# Altium schematic sheet RL78.SchDoc: RL78
size A4; DrawnBy: JR; Revision: 0.1; SheetNumber: 1; SheetTotal: 1
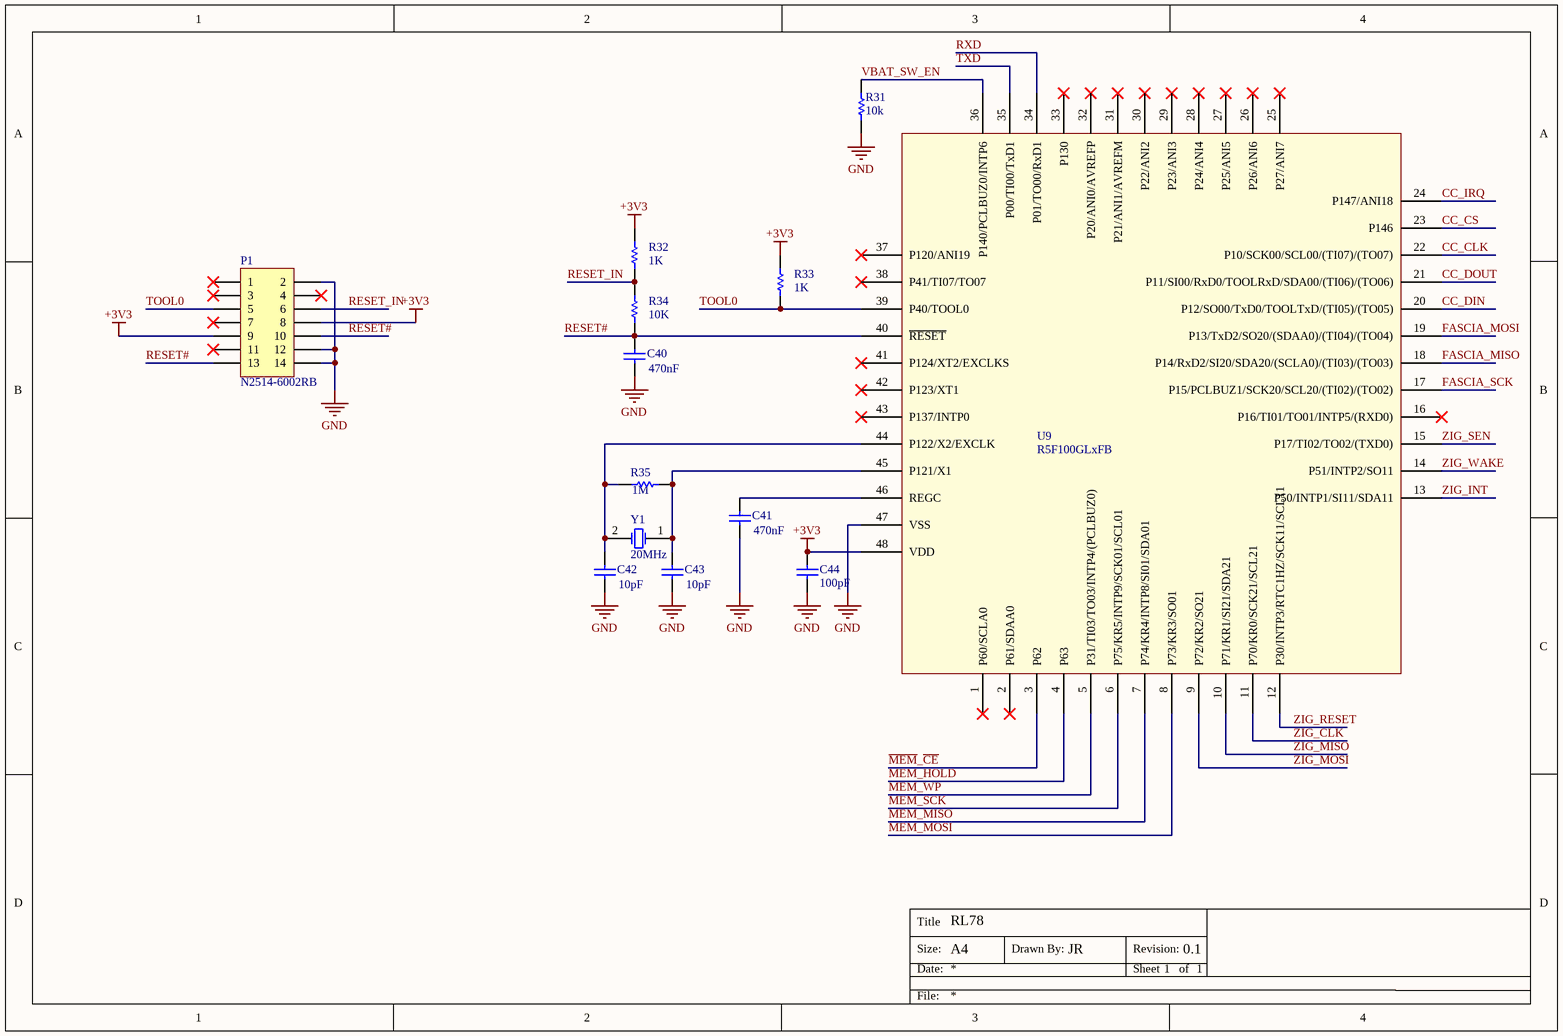
[diagram p0: RL78.SchDoc]

## Parts
C40  value 470nF  [CAPC1005L]  (hidden comment: Cap)
C41  value 470nF  [CAPC1005L]  (hidden comment: Cap)
C42  value 10pF  [CAPC1005L]  (hidden comment: Cap)
C43  value 10pF  [CAPC1005L]  (hidden comment: Cap)
C44  value 100pF  [CAPC1005L]  (hidden comment: Cap)
P1  N2514-6002RB  [N2514-6002RB]
R31  value 10k  [RESC1005L]  (hidden comment: RC0603JR-0768KL)
R32  value 1K  [RESC1608L]  (hidden comment: Res1)
R33  value 1K  [RESC1005L]  (hidden comment: Res1)
R34  value 10K  [RESC1608L]  (hidden comment: Res1)
R35  value 1M  [RESC1005L]  (hidden comment: Res1)
U9  R5F100GLxFB  [R5F100GLxFB]
Y1  20MHz  [32Mhz Crystal]

## Nets
+3V3: C44.2 P1.8 P1.9 R32.2 R33.2 U9.48(VDD)
GND: C40.1 C41.1 C42.1 C43.1 C44.1 P1.2 P1.12 P1.14 R31.2 U9.47(VSS)
CC_CLK: U9.22(P10/SCK00/SCL00/(TI07)/(TO07))
CC_CS: U9.23(P146)
CC_DIN: U9.20(P12/SO00/TxD0/TOOLTxD/(TI05)/(TO05))
CC_DOUT: U9.21(P11/SI00/RxD0/TOOLRxD/SDA00/(TI06)/(TO06))
CC_IRQ: U9.24(P147/ANI18)
FASCIA_MISO: U9.18(P14/RxD2/SI20/SDA20/(SCLA0)/(TI03)/(TO03))
FASCIA_MOSI: U9.19(P13/TxD2/SO20/(SDAA0)/(TI04)/(TO04))
FASCIA_SCK: U9.17(P15/PCLBUZ1/SCK20/SCL20/(TI02)/(TO02))
~{MEM}_~{CE}: U9.3(P62)
~{MEM}_~{HOLD}: U9.4(P63)
~{MEM}_~{WP}: U9.5(P31/TI03/TO03/INTP4/(PCLBUZ0))
MEM_MISO: U9.7(P74/KR4/INTP8/SI01/SDA01)
MEM_MOSI: U9.8(P73/KR3/SO01)
MEM_SCK: U9.6(P75/KR5/INTP9/SCK01/SCL01)
RESET#: C40.2 P1.10 P1.13 R34.1 U9.40(~{RESET})
RESET_IN: P1.6 R32.1 R34.2
RXD: U9.34(P01/TO00/RxD1)
TOOL0: P1.5 R33.1 U9.39(P40/TOOL0)
TXD: U9.35(P00/TI00/TxD1)
VBAT_SW_EN: R31.1 U9.36(P140/PCLBUZ0/INTP6)
ZIG_CLK: U9.11(P70/KR0/SCK21/SCL21)
ZIG_INT: U9.13(P50/INTP1/SI11/SDA11)
ZIG_MISO: U9.10(P71/KR1/SI21/SDA21)
ZIG_MOSI: U9.9(P72/KR2/SO21)
ZIG_RESET: U9.12(P30/INTP3/RTC1HZ/SCK11/SCL11)
ZIG_SEN: U9.15(P17/TI02/TO02/(TXD0))
ZIG_WAKE: U9.14(P51/INTP2/SO11)
NetC41_2: C41.2 U9.46(REGC)
NetC42_2: C42.2 R35.2 U9.44(P122/X2/EXCLK) Y1.2(OSC2)
NetC43_2: C43.2 R35.1 U9.45(P121/X1) Y1.1(OSC1)

Not connected (* = marked no-connect by the designer): P1 1* 3* 4* 7* 11*; U9 1(P60/SCLA0)* 2(P61/SDAA0)* 16(P16/TI01/TO01/INTP5/(RXD0))* 25(P27/ANI7)* 26(P26/ANI6)* 27(P25/ANI5)* 28(P24/ANI4)* 29(P23/ANI3)* 30(P22/ANI2)* 31(P21/ANI1/AVREFM)* 32(P20/ANI0/AVREFP)* 33(P130)* 37(P120/ANI19)* 38(P41/TI07/TO07)* 41(P124/XT2/EXCLKS)* 42(P123/XT1)* 43(P137/INTP0)*

## Notes on the sheet
- Title
- Size:
- Date:
- A4
- Drawn By:
- Revision:
- Sheet
- of
- File:

## Library data of the parts
C40-C44 = Cap: Capacitor; Published: 8-Jun-2000; LatestRevisionDate: 17-Jul-2002; LatestRevisionNote: Re-released for DXP Platform.; PackageReference: RAD-0.3; Publisher: Altium Limited; PackageDescription: Radial Cap, Thru-Hole; 2 Leads; 0.3 in Pin Spacing
P1 = Header 7X2: Header, 7-Pin, Dual row N2514-6002RB; LatestRevisionDate: 17-Jul-2002; LatestRevisionNote: Re-released for DXP Platform.; Publisher: Altium Limited
R31 = Res Semi: Resistor, 68kOhm, 1/10W, 5%, 0603; Manufacturer: Yageo; Package: 0603
R32-R35 = Res1: Resistor; Published: 8-Jun-2000; LatestRevisionDate: 17-Jul-2002; LatestRevisionNote: Re-released for DXP Platform.; PackageReference: AXIAL-0.3; Publisher: Altium Limited; PackageDescription: Axial Device, Thru-Hole; 2 Leads; 0.3 in Pin Spacing
Y1 = XTAL: Crystal Oscillator; Published: 8-Jun-2000; LatestRevisionDate: 17-Jul-2002; LatestRevisionNote: Re-released for DXP Platform.; PackageReference: R38; Publisher: Altium Limited; PackageDescription: Crystal, Thru-Hole; 2 Leads; Body 3.1 x 8.2 mm (Dia.xH)